# Altium project charge_hub_V1.PrjPcb
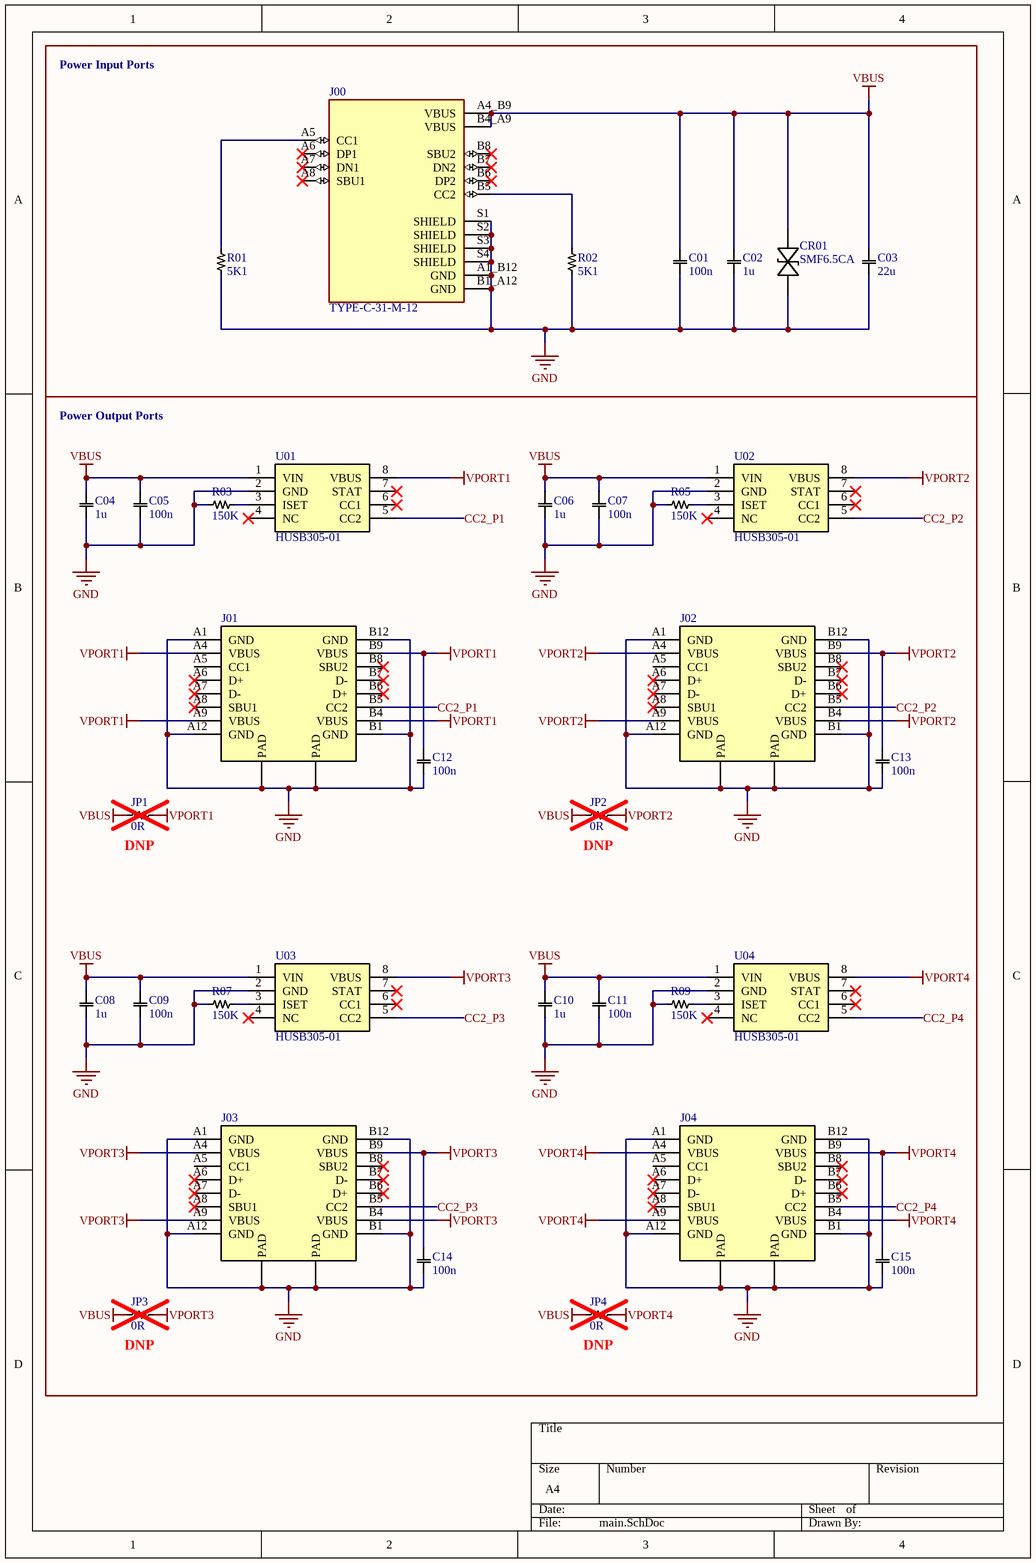
[diagram p0: main.SchDoc]
1 sheet, 35 parts. Net scope: global (net labels, ports and power ports of the same name join across sheets).
Board file: main.PcbDoc

## Sheet main.SchDoc
size A4 portrait; SheetNumber: 1; SheetTotal: 1

### Parts
C01  100n  [RC0603N_YAG]
C02  1u  [RC0603N_YAG]
C03  22u  [RC1210]
C04  1u  [RC0603N_YAG]
C05  100n  [RC0603N_YAG]
C06  1u  [RC0603N_YAG]
C07  100n  [RC0603N_YAG]
C08  1u  [RC0603N_YAG]
C09  100n  [RC0603N_YAG]
C10  1u  [RC0603N_YAG]
C11  100n  [RC0603N_YAG]
C12  100n  [RC0603N_YAG]
C13  100n  [RC0603N_YAG]
C14  100n  [RC0603N_YAG]
C15  100n  [RC0603N_YAG]
CR01  SMF6.5CA  [SOD-123F_LTF]
J00  TYPE-C-31-M-12  [HRO_TYPE-C-31-M-12]
J01  TYPE-C MALE  [TYPE-C MALE]  (value not drawn)
J02  TYPE-C MALE  [TYPE-C MALE]  (value not drawn)
J03  TYPE-C MALE  [TYPE-C MALE]  (value not drawn)
J04  TYPE-C MALE  [TYPE-C MALE]  (value not drawn)
JP1  0R  [RC0603N_YAG]
JP2  0R  [RC0603N_YAG]
JP3  0R  [RC0603N_YAG]
JP4  0R  [RC0603N_YAG]
R01  5K1  [RC0603N_YAG]
R02  5K1  [RC0603N_YAG]
R03  150K  [RC0603N_YAG]
R05  150K  [RC0603N_YAG]
R07  150K  [RC0603N_YAG]
R09  150K  [RC0603N_YAG]
U01  HUSB305-01  [TSOT23-8L]
U02  HUSB305-01  [TSOT23-8L]
U03  HUSB305-01  [TSOT23-8L]
U04  HUSB305-01  [TSOT23-8L]

### Blocks framed on the sheet
Power Input Ports: C01 C02 C03 CR01 J00 R01 R02

### Nets
GND: C01.2 C02.2 C03.2 C04.2 C05.2 C06.2 C07.2 C08.2 C09.2 C10.2 C11.2 C12.2 C13.2 C14.2 C15.2 CR01.2 J00.A1_B12(GND) J00.B1_A12(GND) J00.S1(SHIELD) J00.S2(SHIELD) J00.S3(SHIELD) J00.S4(SHIELD) J01.A1(GND) J01.A12(GND) J01.B1(GND) J01.B12(GND) J01.P1(PAD) J01.P2(PAD) J02.A1(GND) J02.A12(GND) J02.B1(GND) J02.B12(GND) J02.P1(PAD) J02.P2(PAD) J03.A1(GND) J03.A12(GND) J03.B1(GND) J03.B12(GND) J03.P1(PAD) J03.P2(PAD) J04.A1(GND) J04.A12(GND) J04.B1(GND) J04.B12(GND) J04.P1(PAD) J04.P2(PAD) R01.2 R02.2 R03.1 R05.1 R07.1 R09.1 U01.2(GND) U02.2(GND) U03.2(GND) U04.2(GND)
VBUS: C01.1 C02.1 C03.1 C04.1 C05.1 C06.1 C07.1 C08.1 C09.1 C10.1 C11.1 CR01.1 J00.A4_B9(VBUS) J00.B4_A9(VBUS) JP1.1 JP2.1 JP3.1 JP4.1 U01.1(VIN) U02.1(VIN) U03.1(VIN) U04.1(VIN)
VPORT1: C12.1 J01.A4(VBUS) J01.A9(VBUS) J01.B4(VBUS) J01.B9(VBUS) JP1.2 U01.8(VBUS)
VPORT2: C13.1 J02.A4(VBUS) J02.A9(VBUS) J02.B4(VBUS) J02.B9(VBUS) JP2.2 U02.8(VBUS)
VPORT3: C14.1 J03.A4(VBUS) J03.A9(VBUS) J03.B4(VBUS) J03.B9(VBUS) JP3.2 U03.8(VBUS)
VPORT4: C15.1 J04.A4(VBUS) J04.A9(VBUS) J04.B4(VBUS) J04.B9(VBUS) JP4.2 U04.8(VBUS)
CC2_P1: J01.B5(CC2) U01.5(CC2)
CC2_P2: J02.B5(CC2) U02.5(CC2)
CC2_P3: J03.B5(CC2) U03.5(CC2)
CC2_P4: J04.B5(CC2) U04.5(CC2)
NetJ00_A5: J00.A5(CC1) R01.1
NetJ00_B5: J00.B5(CC2) R02.1
NetR03_2: R03.2 U01.3(ISET)
NetR05_2: R05.2 U02.3(ISET)
NetR07_2: R07.2 U03.3(ISET)
NetR09_2: R09.2 U04.3(ISET)

Not connected (* = marked no-connect by the designer): J00 A6(DP1)* A7(DN1)* A8(SBU1)* B6(DP2)* B7(DN2)* B8(SBU2)*; J01 A5(CC1) A6(D+)* A7(D-)* A8(SBU1)* B6(D+)* B7(D-)* B8(SBU2)*; J02 A5(CC1) A6(D+)* A7(D-)* A8(SBU1)* B6(D+)* B7(D-)* B8(SBU2)*; J03 A5(CC1) A6(D+)* A7(D-)* A8(SBU1)* B6(D+)* B7(D-)* B8(SBU2)*; J04 A5(CC1) A6(D+)* A7(D-)* A8(SBU1)* B6(D+)* B7(D-)* B8(SBU2)*; U01 4(NC)* 6(CC1)* 7(STAT)*; U02 4(NC)* 6(CC1)* 7(STAT)*; U03 4(NC)* 6(CC1)* 7(STAT)*; U04 4(NC)* 6(CC1)* 7(STAT)*

### Notes on the sheet
- Power Output Ports
- (near JP1) DNP
- (near JP2) DNP
- (near JP3) DNP
- (near JP4) DNP

### Library data of the parts
C01 C02 C03 C04 C05 C06 C07 C08 C09-C15 = Capacitor: Manufacturer_Name: Yageo; Manufacturer_Part_Number: RC0603FR-0747KL; Copyright: Copyright (C) 2025 Ultra Librarian. All rights reserved.
CR01 = SMF6.5CA: Description; Manufacturer_Name: Littelfuse Inc; Copyright: Copyright (C) 2026 Ultra Librarian. All rights reserved.; Manufacturer_Part_Number: SMF6.5CA
J00 = TYPE-C-31-M-12: USB Connectors 24 Receptacle 1 8.94*7.3mm RoHS; MF: HRO Electronics Co., Ltd.; SnapEDA_Link: https://www.snapeda.com/parts/TYPE-C-31-M-12/HRO+Electronics+Co.%252C+Ltd./view-part/?ref=snap; Package: Package; Value: *; MP: TYPE-C-31-M-12; Check_prices: https://www.snapeda.com/parts/TYPE-C-31-M-12/HRO+Electronics+Co.%252C+Ltd./view-part/?ref=eda
JP1-JP4 R01 R02 R03 R05 R07 R09 = RC0603: RES SMD 47K OHM 1% 1/10W 0603; Manufacturer_Name: Yageo; Manufacturer_Part_Number: RC0603FR-0747KL; Copyright: Copyright (C) 2025 Ultra Librarian. All rights reserved.